# Altium schematic sheet SpeakerEngine.SchDoc
size A4
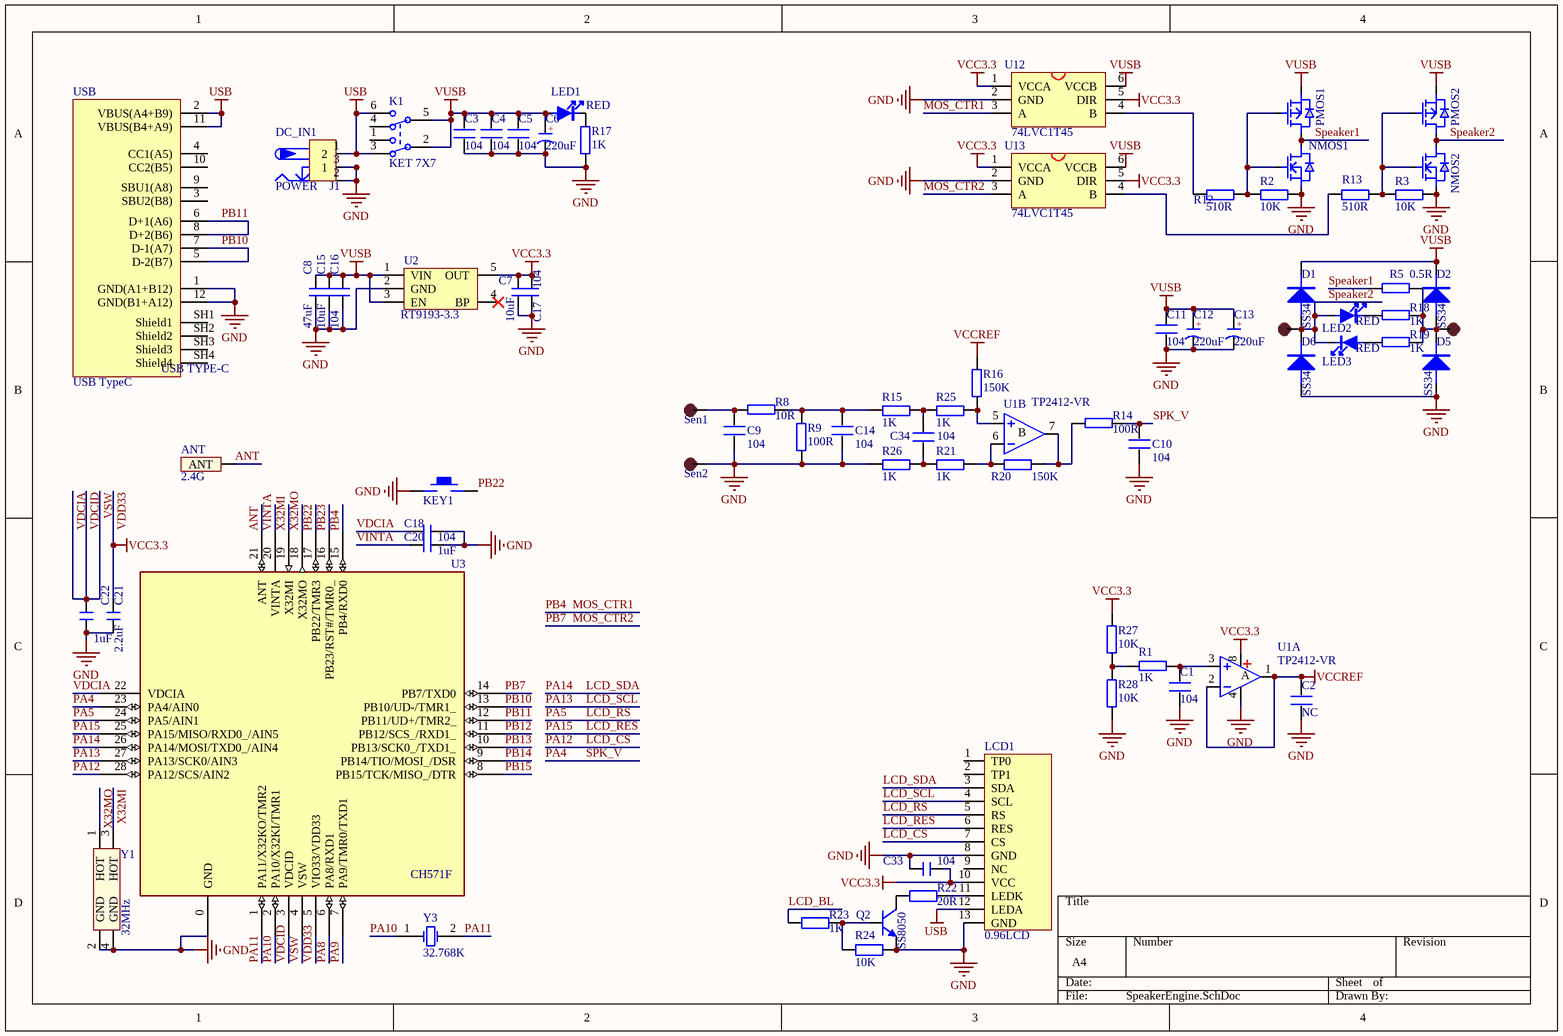
[diagram p0: SpeakerEngine.SchDoc]

## Parts
ANT  2.4G  [2.4GANTS8]
C1  104  [C 0603_L]
C2  NC  [C 0603_L]
C3  104  [C 0603_L]
C4  104  [C 0603_L]
C5  104  [C 0603_L]
C6  220uF  [CM D(6.3*5.4)]
C7  10uF  [C 0603_L]
C8  47uF  [C 0603_L]
C9  104  [C 0603_L]
C10  104  [C 0603_L]
C11  104  [C 0603_L]
C12  220uF  [CM D(6.3*5.4)]
C13  220uF  [CM D(6.3*5.4)]
C14  104  [C 0603_L]
C15  10uF  [C 0603_L]
C16  104  [C 0603_L]
C17  104  [C 0603_L]
C18  104  [C 0603_L]
C20  1uF  [C 0603_L]
C21  2.2uF  [C 0603_L]
C22  1uF  [C 0603_L]
C33  104  [C 0603_L]
C34  104  [C 0603_L]
D1  SS34  [SMA]
D2  SS34  [SMA]
D5  SS34  [SMA]
D6  SS34  [SMA]
DC_IN1  POWER  [DC-005]
J1  Header 1X2  [HDR2.54-LI-2P]  (value not drawn)
K1  KET 7X7  [KFT DIP-8X8]
KEY1  KEY-SMD  [TSW SMD-3*6*2.5]  (value not drawn)
LCD1  0.96LCD  [LCD 0.96 13P]
LED1  RED  [LED 0603B]
LED2  RED  [LED 0603B]
LED3  RED  [LED 0603B]
NMOS1  SI2302  [SOT23-3L]  (value not drawn)
NMOS2  SI2302  [SOT23-3L]  (value not drawn)
PMOS1  SI2301  [SOT23-3L]  (value not drawn)
PMOS2  SI2301  [SOT23-3L]  (value not drawn)
Q2  SS8050  [SOT23-3L]
R1  1K  [R 0603_L]
R2  10K  [R 0603_L]
R3  10K  [R 0603_L]
R5  0.5R  [R 0805_L]
R8  10R  [R 0603_L]
R9  100R  [R 0603_L]
R12  510R  [R 0603_L]
R13  510R  [R 0603_L]
R14  100R  [R 0603_L]
R15  1K  [R 0603_L]
R16  150K  [R 0603_L]
R17  1K  [R 0603_L]
R18  1K  [R 0603_L]
R19  1K  [R 0603_L]
R20  150K  [R 0603_L]
R21  1K  [R 0603_L]
R22  20R  [R 0603_L]
R23  1K  [R 0603_L]
R24  10K  [R 0603_L]
R25  1K  [R 0603_L]
R26  1K  [R 0603_L]
R27  10K  [R 0603_L]
R28  10K  [R 0603_L]
Sen1  SPK+  [TP-1.5]  (value not drawn)
Sen2  SPK+  [TP-1.5]  (value not drawn)
Speaker1  SPK+  [TP-1.5]  (value not drawn)
Speaker2  SPK+  [TP-1.5]  (value not drawn)
U1  TP2412-VR  [SSOP8_N]  (parts A,B of 2)
U2  RT9193-3.3  [SOT23-5L]
U3  CH571F  [QFN28_4X4]
U12  74LVC1T45  [SOT363-6L]
U13  74LVC1T45  [SOT363-6L]
USB  USB TypeC  [USB Type-C]
Y1  32MHz  [OSC 3225-4P]
Y3  32.768K  [OSC 3215-2P]

## Nets
GND: C1.1 C2.1 C3.1 C4.1 C5.1 C6.2(K) C7.2 C8.2 C9.1 C10.1 C11.1 C12.2(K) C13.2(K) C14.1 C15.2 C16.2 C17.2 C18.2 C20.2 C21.2 C22.2 C33.2 D5.1(A) D6.1(A) DC_IN1.2 DC_IN1.3 J1.1 KEY1.1 LCD1.8(GND) LCD1.13(GND) NMOS1.2(S) NMOS2.2(S) Q2.2(E) R2.2 R3.2 R9.2 R17.2 R24.2 R26.1 R28.2 Sen2.1 U1.4(V-) U2.2(GND) U3.0(GND) U12.2(GND) U13.2(GND) USB.1(GND(A1+B12)) USB.12(GND(B1+A12)) Y1.2(GND) Y1.4(GND)
USB: DC_IN1.1 J1.2 K1.3(NO1) K1.6(NC2) LCD1.12(LEDA) USB.2(VBUS(A4+B9)) USB.11(VBUS(B4+A9))
VCCREF: C2.2 R16.1 U1.1(OUT) U1.2(IN-)
VDD33: C7.1 C17.1 C21.1 C33.1 LCD1.10(VCC) R27.1 U1.8(V+) U2.5(OUT) U3.5(VIO33/VDD33) U12.1(VCCA) U12.5(DIR) U13.1(VCCA) U13.5(DIR)  [also labelled VCC3.3]
VUSB: C3.2 C4.2 C5.2 C6.1(A) C8.1 C11.2 C12.1(A) C13.1(A) C15.1 C16.1 D1.2(K) D2.2(K) K1.2(COM1) K1.5(COM2) LED1.1 PMOS1.2(S) PMOS2.2(S) U2.1(VIN) U2.3(EN) U12.6(VCCB) U13.6(VCCB)
ANT: ANT.1(ANT) U3.21(ANT)
LCD_BL: R23.1
LCD_CS: LCD1.7(CS) U3.28(PA12/SCS/AIN2)  [also labelled PA12]
LCD_RES: LCD1.6(RES) U3.25(PA15/MISO/RXD0_/AIN5)  [also labelled PA15]
LCD_RS: LCD1.5(RS) U3.24(PA5/AIN1)  [also labelled PA5]
LCD_SCL: LCD1.4(SCL) U3.27(PA13/SCK0/AIN3)  [also labelled PA13]
LCD_SDA: LCD1.3(SDA) U3.26(PA14/MOSI/TXD0_/AIN4)  [also labelled PA14]
MOS_CTR1: U3.15(PB4/RXD0) U12.3(A)  [also labelled PB4]
MOS_CTR2: U3.14(PB7/TXD0) U13.3(A)  [also labelled PB7]
PA4: C10.2 R14.1 U3.23(PA4/AIN0)  [also labelled SPK_V]
PA8: U3.6(PA8/RXD1)
PA9: U3.7(PA9/TMR0/TXD1)
PA10: U3.2(PA10/X32KI/TMR1) Y3.1(OSC1)
PA11: U3.1(PA11/X32KO/TMR2) Y3.2(OSC2)
PB10: U3.13(PB10/UD-/TMR1_) USB.5(D-2(B7)) USB.7(D-1(A7))
PB11: U3.12(PB11/UD+/TMR2_) USB.6(D+1(A6)) USB.8(D+2(B6))
PB12: U3.11(PB12/SCS_/RXD1_)
PB13: U3.10(PB13/SCK0_/TXD1_)
PB14: U3.9(PB14/TIO/MOSI_/DSR)
PB15: U3.8(PB15/TCK/MISO_/DTR)
PB22: KEY1.2 U3.17(PB22/TMR3)
PB23: U3.16(PB23/RST#/TMR0_)
Speaker1: NMOS1.3(D) PMOS1.3(D) R5.2
Speaker2: D1.1(A) D6.2(K) LED2.1 LED3.2 NMOS2.3(D) PMOS2.3(D) Speaker1.1
VDCIA: C18.1 C22.1 U3.3(VDCID) U3.4(VSW) U3.22(VDCIA)  [also labelled VDCID, VSW]
VINTA: C20.1 U3.20(VINTA)
X32MI: U3.19(X32MI) Y1.3(HOT)
X32MO: U3.18(X32MO) Y1.1(HOT)
NetC1_2: C1.2 R1.1 U1.3(IN+)
NetC9_2: C9.2 R8.2 Sen1.1
NetC14_2: C14.2 R8.1 R9.1 R15.1
NetC34_1: C34.1 R21.1 R26.2
NetC34_2: C34.2 R15.2 R25.1
NetD2_1: D2.1(A) D5.2(K) R5.1 R18.1 R19.1 Speaker2.1
NetLCD1_11: LCD1.11(LEDK) R22.2
NetLED1_2: LED1.2 R17.1
NetLED2_2: LED2.2 R18.2
NetLED3_1: LED3.1 R19.2
NetNMOS1_1: NMOS1.1(G) PMOS1.1(G) R2.1 R12.2
NetNMOS2_1: NMOS2.1(G) PMOS2.1(G) R3.1 R13.2
NetQ2_1: Q2.1(B) R23.2 R24.1
NetQ2_3: Q2.3(C) R22.1
NetR1_2: R1.2 R27.2 R28.1
NetR12_1: R12.1 U12.4(B)
NetR13_1: R13.1 U13.4(B)
NetR14_2: R14.2 R20.2 U1.7(OUT)
NetR16_2: R16.2 R25.2 U1.5(IN+)
NetR20_1: R20.1 R21.2 U1.6(IN-)

Not connected (* = marked no-connect by the designer): K1 1(NC1) 4(NO2); LCD1 1(TP0) 2(TP1) 9(NC); U2 4(BP)*; USB 3(SBU2(B8)) 4(CC1(A5)) 9(SBU1(A8)) 10(CC2(B5)) SH1(Shield1) SH2(Shield2) SH3(Shield3) SH4(Shield4)

## Notes on the sheet
- (in symbol C-CAP) +
- (in symbol LMV358, part A) A
- (in symbol LMV358, part B) B
- (in symbol USB 2.0 Type C) USB TYPE-C

## Library data of the parts
ANT = ANT: 2.4G天线
C1-C5 C9-C11 C14 C34 = C
C6 C12 C13 = C-CAP: 有极性电容; 版权归属: 正点原子; 学习资源: www.openedv.com; BOM名称: 有极性电容
C7 C8 C15-C17 = C: 无极性贴片电容; 版权归属: 正点原子; BOM名称: 无极性贴片电容; 学习资源: www.openedv.com
C18 C20-C22 = C: 无极性贴片电容; BOM名称: 无极性贴片电容
C33 = C: 无极性电容; BOM名称: 无极性贴片电容; 版权归属: 正点原子; 学习资源: www.openedv.com
D1 D2 D5 D6 = DIODE: 整流二极管
DC_IN1 = P-DC: 低压电源接口; BOM名称: DC电源接口; 版权归属: 源创客; 学习资源: www.ooocke.com
J1 = Header 2: 2P接插件; 版权归属: 正点原子; Parameter: 接插件; BOM名称: 2P接插件; 学习资源: www.openedv.com
K1 = KET 7X7: 7*7自锁开关; 版权归属: 正点原子; Parameter: 按键/开关; BOM名称: 7*7自锁开关; 学习资源: www.openedv.com
KEY1 = S-KEY-SMD-324225: KEY,SMD,324225
LCD1 = LCD 0.96: 0.96 LCD 80*160; BOM名称: 12864 点阵屏; 版权归属: 正点原子; Parameter: 显示器件; 学习资源: www.openedv.com
LED1-LED3 = LED: 发光二极管
NMOS1 NMOS2 = NMOS: SOT-23
PMOS1 PMOS2 = PMOS: SOT-23
Q2 = 8050-SMD: 高频放大-NPN型; 版权归属: 正点原子; 属性: 40V 1.5A 1W 100MHZ; Parameter: 三极管; BOM名称: 高频放大-NPN型; 学习资源: www.openedv.com
R1-R3 R5 R8 R9 R12-R21 R25-R28 = R
R22-R24 = R: 贴片电阻
Sen1 Sen2 Speaker1 Speaker2 = TEST-POINT: 测试点
U1 = LMV358: 低压轨至轨双运放,5.5V 1MHz 4mV; BOM名称: 双路运放; 版权归属: 正点原子; Parameter: 芯片; 学习资源: www.openedv.com
U2 = LDO RT9193: LDO; BOM名称: 稳压芯片; 版权归属: 正点原子; 学习资源: www.openedv.com
U3 = CH571F: RISC-V MCU with BLE/USB/ADC/SPI/2*UART
U12 U13 = 74LVC1T45: 1路双向电平转换
USB = USB 2.0 Type C: 12P TypeC 母座; 版权归属: 正点原子; Parameter: 接口器件; 学习资源: www.openedv.com
Y1 = Y-3225-4P: 晶振25MHz; Published: 8-Jun-2000; LatestRevisionDate: 17-Jul-2002; LatestRevisionNote: Re-released for DXP Platform.; Publisher: Altium Limited
Y3 = Y-3215-2P: 晶振32.768K; Published: 8-Jun-2000; LatestRevisionDate: 17-Jul-2002; LatestRevisionNote: Re-released for DXP Platform.; Publisher: Altium Limited